# EAGLE schematic Self Balancing Bot1 (EAGLE 7.6.0)
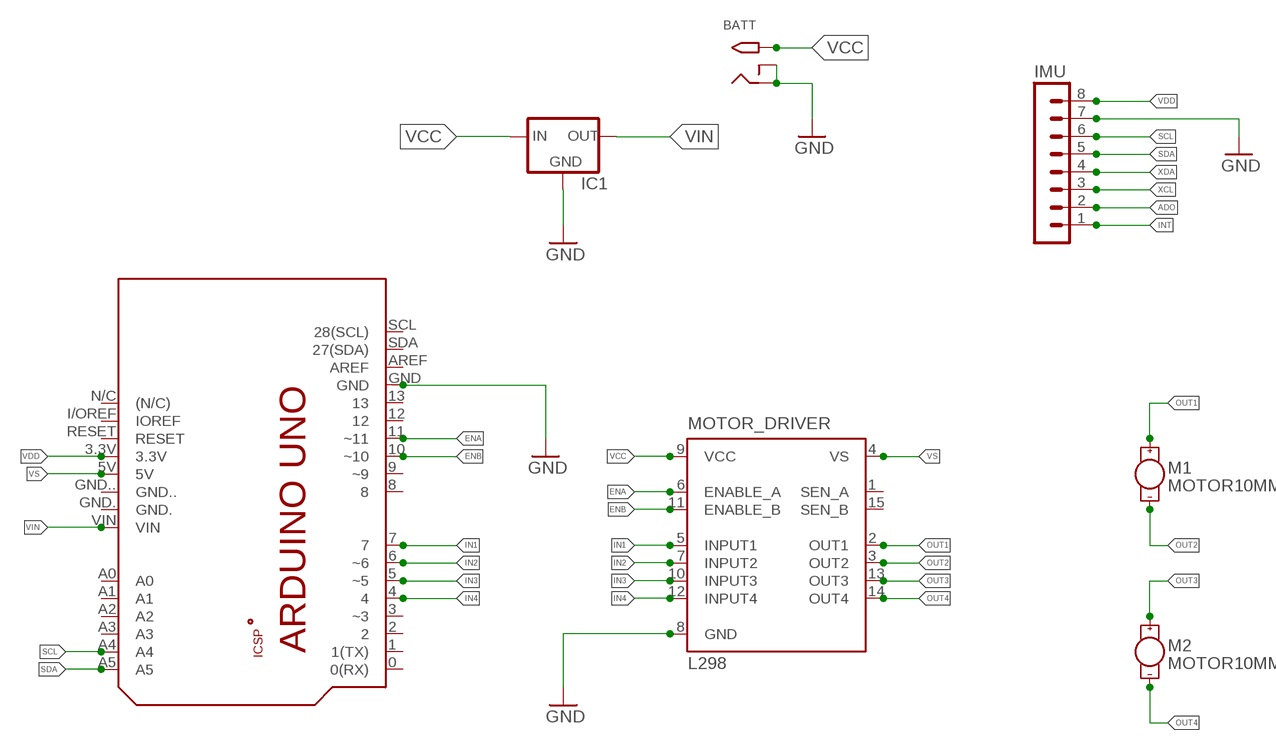
[diagram p0: schematic, sheet 1]

## Parts
ARDUINO_UNO  ARDUINO_UNO  [ARDUINO_UNO]
BATT  2.1MM_POWER_JACKTHM  [POWER_JACK]
IC1  VOLTAGE_REGULATOR_78XXS  [78XXS]
IMU  RELIMATE_08-1  [MA08-1]
M1  MOTOR10MM  [VIBE-MOTOR-10MM]
M2  MOTOR10MM  [VIBE-MOTOR-10MM]
MOTOR_DRIVER  L298  [MULTIWATT-15]

## Nets
ADO: IMU.2
ENA: ARDUINO_UNO.11(~11) MOTOR_DRIVER.6(ENABLE_A)
ENB: ARDUINO_UNO.10(~10) MOTOR_DRIVER.11(ENABLE_B)
GND: ARDUINO_UNO.GND BATT.RING BATT.RING_SW IC1.GND IMU.7 MOTOR_DRIVER.8(GND)
IN1: ARDUINO_UNO.7 MOTOR_DRIVER.5(INPUT1)
IN2: ARDUINO_UNO.6(~6) MOTOR_DRIVER.7(INPUT2)
IN3: ARDUINO_UNO.5(~5) MOTOR_DRIVER.10(INPUT3)
IN4: ARDUINO_UNO.4 MOTOR_DRIVER.12(INPUT4)
INT: IMU.1
OUT1: M1.+ MOTOR_DRIVER.2(OUT1)
OUT2: M1.- MOTOR_DRIVER.3(OUT2)
OUT3: M2.+ MOTOR_DRIVER.13(OUT3)
OUT4: M2.- MOTOR_DRIVER.14(OUT4)
SCL: ARDUINO_UNO.A4 IMU.6
SDA: ARDUINO_UNO.A5 IMU.5
VCC: BATT.TIP IC1.IN MOTOR_DRIVER.9(VCC)
VDD: ARDUINO_UNO.3.3V IMU.8
VIN: ARDUINO_UNO.VIN IC1.OUT
VS: ARDUINO_UNO.5V MOTOR_DRIVER.4(VS)
XCL: IMU.3
XDA: IMU.4
Unconnected: ARDUINO_UNO.0(0(RX)) ARDUINO_UNO.1(1(TX)) ARDUINO_UNO.2 ARDUINO_UNO.3(~3) ARDUINO_UNO.8 ARDUINO_UNO.9(~9) ARDUINO_UNO.12 ARDUINO_UNO.13 ARDUINO_UNO.+5V ARDUINO_UNO.A0 ARDUINO_UNO.A1 ARDUINO_UNO.A2 ARDUINO_UNO.A3 ARDUINO_UNO.AREF ARDUINO_UNO.GND. ARDUINO_UNO.GND.. ARDUINO_UNO.GND_ ARDUINO_UNO.I/OREF(IOREF) ARDUINO_UNO.MISO ARDUINO_UNO.MOSI ARDUINO_UNO.N/C((N/C)) ARDUINO_UNO.RESET ARDUINO_UNO.RESET. ARDUINO_UNO.SCK ARDUINO_UNO.SCL(28(SCL)) ARDUINO_UNO.SDA(27(SDA)) MOTOR_DRIVER.1(SEN_A) MOTOR_DRIVER.15(SEN_B)

## Library data of the parts
ARDUINO_UNO = robocon:ARDUINO_UNO: Device for representing an Arduino Uno board with a footprint in an EAGLE design. Created by Dave Young for Element14. More EAGLE documentation at: http://www.element14.com/community/community/knode/cadsoft_eagle
BATT = robocon:2.1MM_POWER_JACK: 2.1mm x 5.5mm THM DC jack with internal switch. Digikey part #PJ-102A, 4UCON part #05537 2.1mm x 5.5mm SMT DC jack with internal switch. Digikey part #PJ-002A-SMT, 4UCON part #03267 By microbuilder.eu & adafruit.com
IC1 = robocon:VOLTAGE_REGULATOR_78XXS: VOLTAGE REGULATOR
IMU = robocon:RELIMATE_08-1: PIN HEADER; OC_FARNELL: unknown; OC_NEWARK: unknown
M1 M2 = SparkFun-Electromechanical:MOTOR: Motor (Single-Phase) Two-terminal, single-phase motors. SparkFun Products Vibration Motor <https://www.sparkfun.com/products/8449> (ROB-08449) Physical dimension and wire connections for this powerful vibration motor. Motor has a self adhesive backing.; PROD_ID: COMP-08572; SF_SKU: ROB-08449
MOTOR_DRIVER = st-microelectronics:L298: DUAL FULL-BRIDGE DRIVER

## Net classes
0 default: width 1.27 mm, drill 1.27 mm, clearance 0.254 mm